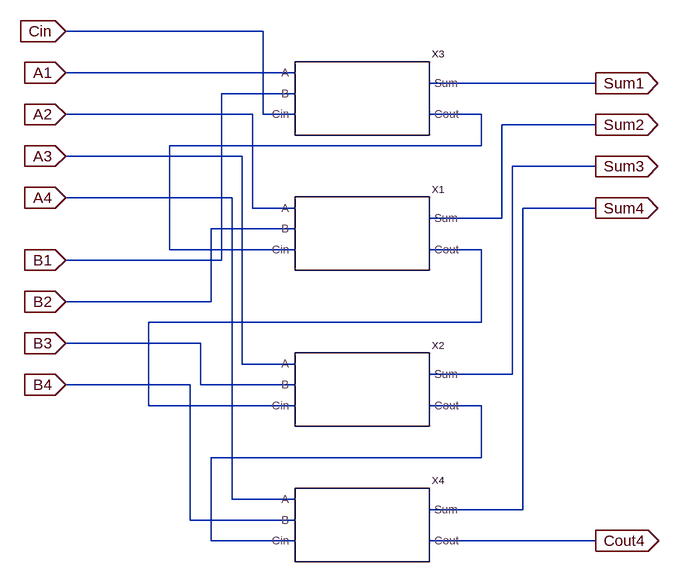
[diagram p0: schematic 8pin_in_Full_Adder.asc]
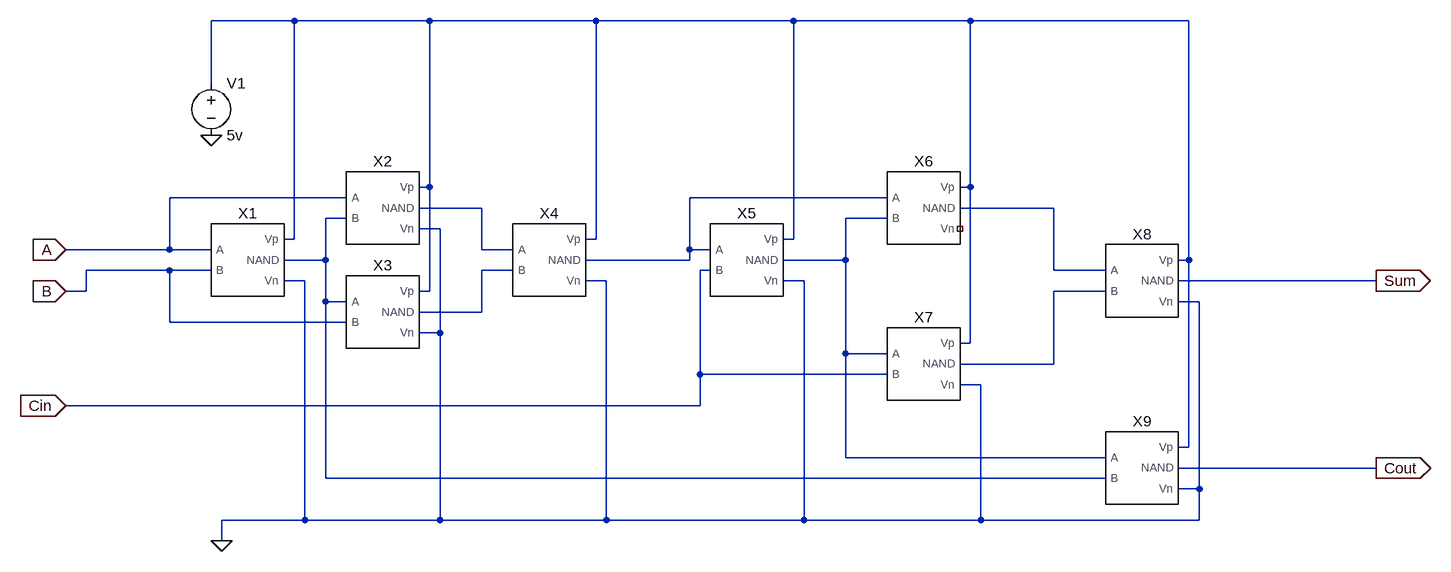
[diagram p1: sub-circuit 1_bit_full_adder.asc]
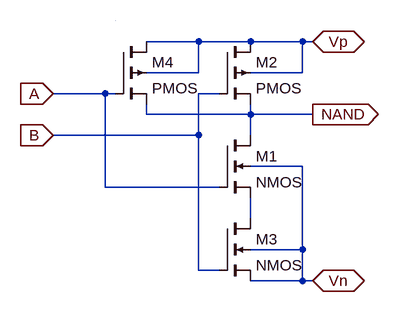
[diagram p2: sub-circuit cmos-nand.asc]
8pin_in_Full_Adder.asc, the LTspice schematic file:
Version 4
SHEET 1 880 680
WIRE 0 -208 -304 -208
WIRE 48 -144 -304 -144
WIRE 512 -128 256 -128
WIRE 48 -112 -64 -112
WIRE -16 -80 -304 -80
WIRE 0 -80 0 -208
WIRE 48 -80 0 -80
WIRE 336 -80 256 -80
WIRE 512 -64 368 -64
WIRE 336 -32 336 -80
WIRE 336 -32 -144 -32
WIRE -32 -16 -304 -16
WIRE 512 0 384 0
WIRE -48 48 -304 48
WIRE -16 64 -16 -80
WIRE 48 64 -16 64
WIRE 512 64 400 64
WIRE 368 80 368 -64
WIRE 368 80 256 80
WIRE 48 96 -80 96
WIRE -144 128 -144 -32
WIRE 48 128 -144 128
WIRE 336 128 256 128
WIRE -64 144 -64 -112
WIRE -64 144 -304 144
WIRE -80 208 -80 96
WIRE -80 208 -304 208
WIRE 336 240 336 128
WIRE 336 240 -176 240
WIRE -96 272 -304 272
WIRE -32 304 -32 -16
WIRE 48 304 -32 304
WIRE 384 320 384 0
WIRE 384 320 256 320
WIRE -112 336 -304 336
WIRE -96 336 -96 272
WIRE 48 336 -96 336
WIRE -176 368 -176 240
WIRE 48 368 -176 368
WIRE 336 368 256 368
WIRE 336 448 336 368
WIRE 336 448 -80 448
WIRE -48 512 -48 48
WIRE 48 512 -48 512
WIRE 400 528 400 64
WIRE 400 528 256 528
WIRE -112 544 -112 336
WIRE 48 544 -112 544
WIRE -80 576 -80 448
WIRE 48 576 -80 576
WIRE 512 576 256 576
FLAG -304 -144 A1
IOPIN -304 -144 In
FLAG -304 -80 A2
IOPIN -304 -80 In
FLAG -304 -16 A3
IOPIN -304 -16 In
FLAG -304 48 A4
IOPIN -304 48 In
FLAG -304 144 B1
IOPIN -304 144 In
FLAG -304 208 B2
IOPIN -304 208 In
FLAG -304 272 B3
IOPIN -304 272 In
FLAG -304 336 B4
IOPIN -304 336 In
FLAG 512 -128 Sum1
IOPIN 512 -128 Out
FLAG 512 -64 Sum2
IOPIN 512 -64 Out
FLAG 512 0 Sum3
IOPIN 512 0 Out
FLAG 512 64 Sum4
IOPIN 512 64 Out
FLAG 512 576 Cout4
IOPIN 512 576 Out
FLAG -304 -208 Cin
IOPIN -304 -208 In
SYMBOL 1_Bit_Full_Adder 144 112 R0
SYMATTR InstName X1
SYMBOL 1_Bit_Full_Adder 144 352 R0
SYMATTR InstName X2
SYMBOL 1_Bit_Full_Adder 144 -96 R0
SYMATTR InstName X3
SYMBOL 1_Bit_Full_Adder 144 560 R0
SYMATTR InstName X4

1_bit_full_adder.asc, the sub-circuit schematic file:
Version 4
SHEET 1 1792 680
WIRE 16 -176 -112 -176
WIRE 224 -176 16 -176
WIRE 480 -176 224 -176
WIRE 784 -176 480 -176
WIRE 1056 -176 784 -176
WIRE 1392 -176 1056 -176
WIRE -112 -80 -112 -176
WIRE 224 80 224 -176
WIRE 224 80 208 80
WIRE 1056 80 1056 -176
WIRE 1056 80 1040 80
WIRE 96 96 -176 96
WIRE 928 96 624 96
WIRE 304 112 208 112
WIRE 1184 112 1040 112
WIRE 96 128 64 128
WIRE 928 128 864 128
WIRE 240 144 208 144
WIRE 16 160 16 -176
WIRE 16 160 0 160
WIRE 480 160 480 -176
WIRE 480 160 464 160
WIRE 784 160 784 -176
WIRE 784 160 768 160
WIRE -176 176 -176 96
WIRE -176 176 -336 176
WIRE -112 176 -176 176
WIRE 304 176 304 112
WIRE 352 176 304 176
WIRE 624 176 624 96
WIRE 656 176 624 176
WIRE 64 192 64 128
WIRE 64 192 0 192
WIRE 624 192 624 176
WIRE 624 192 464 192
WIRE 864 192 864 128
WIRE 864 192 768 192
WIRE 1392 192 1392 -176
WIRE 1392 192 1376 192
WIRE -176 208 -304 208
WIRE -112 208 -176 208
WIRE 352 208 304 208
WIRE 656 208 640 208
WIRE 1184 208 1184 112
WIRE 1264 208 1184 208
WIRE 32 224 0 224
WIRE 496 224 464 224
WIRE 800 224 768 224
WIRE 1680 224 1376 224
WIRE -304 240 -304 208
WIRE -304 240 -336 240
WIRE 224 240 224 80
WIRE 224 240 208 240
WIRE 1264 240 1184 240
WIRE 64 256 64 192
WIRE 96 256 64 256
WIRE 1408 256 1376 256
WIRE 304 272 304 208
WIRE 304 272 208 272
WIRE -176 288 -176 208
WIRE 96 288 -176 288
WIRE 240 304 240 144
WIRE 240 304 208 304
WIRE 1056 320 1056 80
WIRE 1056 320 1040 320
WIRE 864 336 864 192
WIRE 928 336 864 336
WIRE 1184 352 1184 240
WIRE 1184 352 1040 352
WIRE 640 368 640 208
WIRE 928 368 640 368
WIRE 1072 384 1040 384
WIRE 640 416 640 368
WIRE 640 416 -336 416
WIRE 1392 480 1392 192
WIRE 1392 480 1376 480
WIRE 864 496 864 336
WIRE 1264 496 864 496
WIRE 1680 512 1376 512
WIRE 64 528 64 256
WIRE 1264 528 64 528
WIRE 1408 544 1408 256
WIRE 1408 544 1376 544
WIRE 32 592 32 224
WIRE 32 592 -96 592
WIRE 240 592 240 304
WIRE 240 592 32 592
WIRE 496 592 496 224
WIRE 496 592 240 592
WIRE 800 592 800 224
WIRE 800 592 496 592
WIRE 1072 592 1072 384
WIRE 1072 592 800 592
WIRE 1408 592 1408 544
WIRE 1408 592 1072 592
WIRE -96 624 -96 592
FLAG -96 624 0
FLAG -336 176 A
IOPIN -336 176 In
FLAG -336 240 B
IOPIN -336 240 In
FLAG -336 416 Cin
IOPIN -336 416 In
FLAG 1680 512 Cout
IOPIN 1680 512 Out
FLAG 1680 224 Sum
IOPIN 1680 224 Out
FLAG -112 0 0
SYMBOL cmos-nand -64 192 R0
SYMATTR InstName X1
SYMBOL cmos-nand 144 112 R0
SYMATTR InstName X2
SYMBOL cmos-nand 144 272 R0
SYMATTR InstName X3
SYMBOL cmos-nand 400 192 R0
SYMATTR InstName X4
SYMBOL cmos-nand 704 192 R0
SYMATTR InstName X5
SYMBOL cmos-nand 976 112 R0
SYMATTR InstName X6
SYMBOL cmos-nand 976 352 R0
SYMATTR InstName X7
SYMBOL cmos-nand 1312 224 R0
SYMATTR InstName X8
SYMBOL cmos-nand 1312 512 R0
SYMATTR InstName X9
SYMBOL voltage -112 -96 R0
WINDOW 123 0 0 Left 0
WINDOW 39 0 0 Left 0
SYMATTR InstName V1
SYMATTR Value 5v

cmos-nand.asc, the sub-circuit schematic file:
Version 4
SHEET 1 880 680
WIRE 128 32 48 32
WIRE 208 32 128 32
WIRE 288 32 208 32
WIRE 304 32 288 32
WIRE 128 80 128 32
WIRE 128 80 48 80
WIRE 288 80 288 32
WIRE 288 80 208 80
WIRE -16 112 -96 112
WIRE 0 112 -16 112
WIRE 160 112 128 112
WIRE 48 144 48 128
WIRE 208 144 208 128
WIRE 208 144 48 144
WIRE 304 144 208 144
WIRE 128 176 128 112
WIRE 128 176 -96 176
WIRE 208 176 208 144
WIRE 288 224 208 224
WIRE -16 256 -16 112
WIRE 160 256 -16 256
WIRE 208 304 208 272
WIRE 288 352 288 224
WIRE 288 352 208 352
WIRE 128 384 128 176
WIRE 160 384 128 384
WIRE 288 400 288 352
WIRE 288 400 208 400
WIRE 304 400 288 400
WIRE 0 0 0 0
FLAG 304 32 Vp
IOPIN 304 32 BiDir
FLAG 304 400 Vn
IOPIN 304 400 BiDir
FLAG 304 144 NAND
IOPIN 304 144 Out
FLAG -96 112 A
IOPIN -96 112 In
FLAG -96 176 B
IOPIN -96 176 In
SYMBOL nmos4 160 176 R0
SYMATTR InstName M1
SYMBOL pmos4 160 32 R0
SYMATTR InstName M2
SYMBOL nmos4 160 304 R0
SYMATTR InstName M3
SYMBOL pmos4 0 32 R0
SYMATTR InstName M4

The netlist it stands for:
* 8pin_in_Full_Adder.asc
XX1 A2 B2 N001 Sum2 N002 1_bit_full_adder
XX2 A3 B3 N002 Sum3 N003 1_bit_full_adder
XX3 A1 B1 Cin Sum1 N001 1_bit_full_adder
XX4 A4 B4 N003 Sum4 Cout4 1_bit_full_adder

* block symbol definitions
.subckt 1_bit_full_adder A B Cin Sum Cout
XX1 A B N005 0 N001 cmos-nand
XX2 A N005 N003 0 N001 cmos-nand
XX3 N005 B N007 0 N001 cmos-nand
XX4 N003 N007 N002 0 N001 cmos-nand
XX5 N002 Cin N006 0 N001 cmos-nand
XX6 N002 N006 N004 NC_01 N001 cmos-nand
XX7 N006 Cin N008 0 N001 cmos-nand
XX8 N004 N008 Sum 0 N001 cmos-nand
XX9 N006 N005 Cout 0 N001 cmos-nand
V1 N001 0 5v
.ends 1_bit_full_adder

.subckt cmos-nand A B NAND Vn Vp
M1 NAND A N001 Vn NMOS
M2 Vp B NAND Vp PMOS
M3 N001 B Vn Vn NMOS
M4 Vp A NAND Vp PMOS
.ends cmos-nand

.model NMOS NMOS
.model PMOS PMOS
.lib standard.mos
.backanno
.end